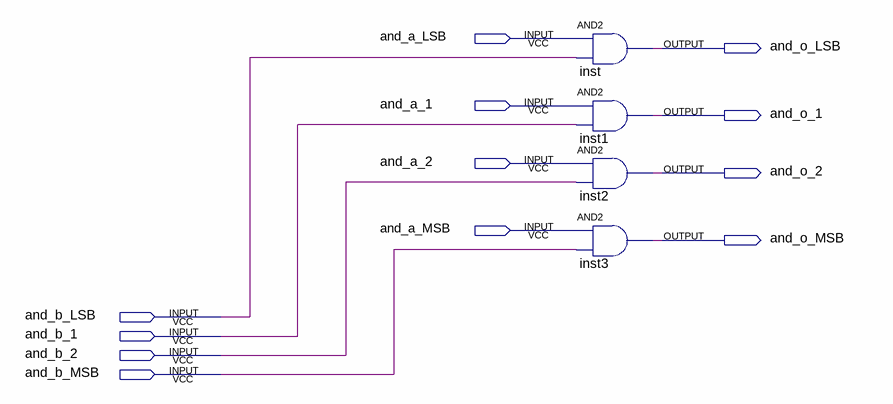
[diagram p0: schematic sheet]
// Quartus schematic 4bit_and.bdf as structural Verilog: 4 symbols, 12 pins
module \4bit_and  (
  input  and_a_LSB,
  input  and_a_1,
  input  and_a_2,
  input  and_a_MSB,
  input  and_b_LSB,
  input  and_b_1,
  input  and_b_2,
  input  and_b_MSB,
  output and_o_LSB,
  output and_o_1,
  output and_o_2,
  output and_o_MSB
);

  and inst (and_o_LSB, and_a_LSB, and_b_LSB);
  and inst1 (and_o_1, and_a_1, and_b_1);
  and inst2 (and_o_2, and_a_2, and_b_2);
  and inst3 (and_o_MSB, and_a_MSB, and_b_MSB);
endmodule
